# EAGLE design Board Schematic (EAGLE 9.1.3)
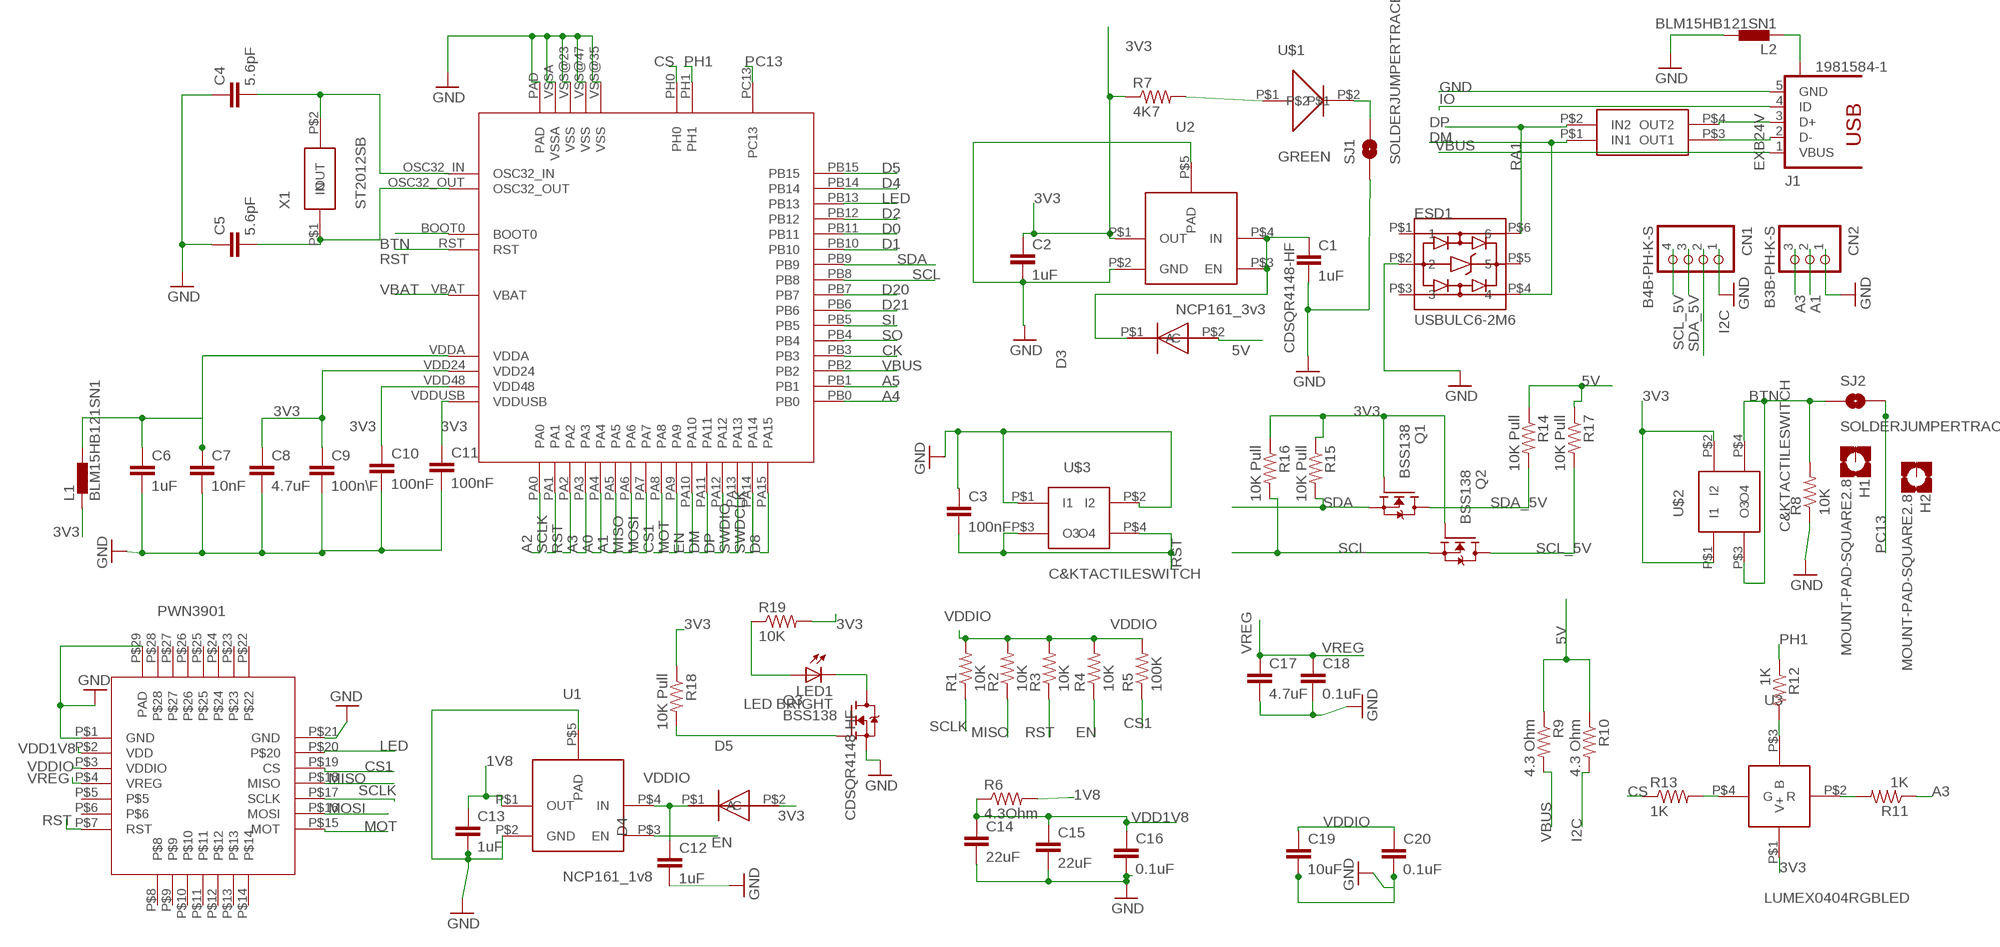
[diagram p0: schematic, sheet 1]

## Parts
C1  1uF  0402CAP.KW  [0402-CAP]
C2  1uF  0402CAP.KW  [0402-CAP]
C3  100nF  0402CAP.KW  [0402-CAP]
C4  5.6pF  0402CAP.KW  [0402-CAP]
C5  5.6pF  0402CAP.KW  [0402-CAP]
C6  1uF  0402CAP.KW  [0402-CAP]
C7  10nF  0402CAP.KW  [0402-CAP]
C8  4.7uF  0402CAP.KW  [0402-CAP]
C9  100n\F  0402CAP.KW  [0402-CAP]
C10  100nF  0402CAP.KW  [0402-CAP]
C11  100nF  0402CAP.KW  [0402-CAP]
C12  1uF  0402CAP.KW  [0402-CAP]
C13  1uF  0402CAP.KW  [0402-CAP]
C14  22uF  0402CAP.KW  [0402-CAP]
C15  22uF  0402CAP.KW  [0402-CAP]
C16  0.1uF  0402CAP.KW  [0402-CAP]
C17  4.7uF  0402CAP.KW  [0402-CAP]
C18  0.1uF  0402CAP.KW  [0402-CAP]
C19  10uF  0402CAP.KW  [0402-CAP]
C20  0.1uF  0402CAP.KW  [0402-CAP]
CN1  B4B-PH-K-S  [B4B-PH-K-S]
CN2  B3B-PH-K-S  [B3B-PH-K-S]
D3  CDSQR4148-HF  [CDSQR4148-HF]
D4  CDSQR4148-HF  [CDSQR4148-HF]
ESD1  USBULC6-2M6  [UQFN6]
H1  MOUNT-PAD-SQUARE2.8  [2,8-PAD-SQUARE]
H2  MOUNT-PAD-SQUARE2.8  [2,8-PAD-SQUARE]
J1  1981584-1  [1981584-1]
L1  BLM15HB121SN1  [0402]
L2  BLM15HB121SN1  [0402]
LED1  LED BRIGHT  LED  [LM561C]
PWN3901  COB_PMW3901  [COB]
Q1  BSS138  [SOT23]
Q2  BSS138  [SOT23]
Q3  BSS138  [SOT23]
R1  10K  0402RES.KW  [0402-RES]
R2  10K  0402RES.KW  [0402-RES]
R3  10K  0402RES.KW  [0402-RES]
R4  10K  0402RES.KW  [0402-RES]
R5  100K  0402RES.KW  [0402-RES]
R6  4.3Ohm  0402RES.KW  [0402-RES]
R7  4K7  0402RES.KW  [0402-RES]
R8  10K  0402RES.KW  [0402-RES]
R9  4.3 Ohm  0402RES.KW  [0402-RES]
R10  4.3 Ohm  0402RES.KW  [0402-RES]
R11  1K  0402RES.KW  [0402-RES]
R12  1K  0402RES.KW  [0402-RES]
R13  1K  0402RES.KW  [0402-RES]
R14  10K Pull  0402RES.KW  [0402-RES]
R15  10K Pull  0402RES.KW  [0402-RES]
R16  10K Pull  0402RES.KW  [0402-RES]
R17  10K Pull  0402RES.KW  [0402-RES]
R18  10K Pull  0402RES.KW  [0402-RES]
R19  10K  0402RES.KW  [0402-RES]
RA1  EXB24V  [EXB24V]
SJ1  SOLDERJUMPERTRACE  [SJ_2S-TRACE]
SJ2  SOLDERJUMPERTRACE  [SJ_2S-TRACE]
U1  NCP161_1v8  NCP161  [NCP161]
U2  NCP161_3v3  NCP161  [NCP161]
U3  LUMEX0404RGBLED  [LX0404]
U$1  GREEN  0402LED  [0402LED]
U$2  C&KTACTILESWITCH  [C&KTACTILESWITCH]
U$3  C&KTACTILESWITCH  [C&KTACTILESWITCH]
U$4  STM32L433  [QFN50P700X700X60-49N]
X1  ST2012SB  [ST2012SB]

## Nets
1V8: C13.1 R6.2 U1.P$1(OUT)
3V3: C2.1 C8.1 C9.1 C10.1 C11.1 D4.P$2(A) L1.1 Q1.1(G) Q2.1(G) R7.1 R15.1 R16.1 R18.1 R19.2 U2.P$1(OUT) U3.P$1(V+) U$2.P$1(I1) U$2.P$2(I2) U$4.VDD24 U$4.VDD48 U$4.VDDUSB
5V: D3.P$2(A) R9.1 R10.1 R14.1 R17.1
A0: U$4.PA4
A1: CN2.2 U$4.PA5
A2: U$4.PA0
A3: CN2.3 R11.1 U$4.PA3
A4: U$4.PB0
A5: U$4.PB1
BTN: R8.2 SJ2.1 U$2.P$3(O3) U$2.P$4(O4) U$4.BOOT0
CK: U$4.PB3
CS: R13.1 U$4.PH0
CS1: PWN3901.P$19(CS) R5.1 U$4.PA8
D0: U$4.PB11
D1: U$4.PB10
D2: U$4.PB12
D4: U$4.PB14
D5: Q3.1(G) R18.2 U$4.PB15
D8: U$4.PA15
D20: U$4.PB7
D21: U$4.PB6
DM: ESD1.P$4 RA1.P$1(IN1) U$4.PA11
DP: ESD1.P$6 RA1.P$2(IN2) U$4.PA12
EN: R4.1 U1.P$3(EN) U$4.PA10
GND: C1.2 C2.2 C3.1 C4.1 C5.1 C6.2 C7.2 C8.2 C9.2 C10.2 C11.2 C12.2 C13.2 C14.2 C15.2 C16.2 C17.2 C18.2 C19.2 C20.2 CN1.1 CN2.1 ESD1.P$2 J1.5(GND) L2.2 PWN3901.P$1(GND) PWN3901.P$21(GND) PWN3901.P$29(PAD) Q3.2(S) R8.1 SJ1.1 U1.P$2(GND) U1.P$5(PAD) U2.P$2(GND) U2.P$5(PAD) U$3.P$1(I1) U$3.P$2(I2) U$4.PAD U$4.VSS@23(VSS) U$4.VSS@35(VSS) U$4.VSS@47(VSS) U$4.VSSA
I2C: CN1.2 R10.2
IO: J1.4(ID)
LED: PWN3901.P$20 U$4.PB13
MISO: PWN3901.P$18(MISO) R2.1 U$4.PA6
MOSI: PWN3901.P$16(MOSI) U$4.PA7
MOT: PWN3901.P$15(MOT) U$4.PA9
N$1: C4.2 U$4.OSC32_IN X1.P$2(OUT)
N$4: C6.1 C7.1 L1.2 U$4.VDDA
N$5: R13.2 U3.P$4(G)
N$6: C5.2 U$4.OSC32_OUT X1.P$1(IN)
N$7: R12.2 U3.P$3(B)
N$8: R11.2 U3.P$2(R)
N$9: J1.S1 L2.1
N$10: J1.3(D+) RA1.P$4(OUT2)
N$11: J1.2(D-) RA1.P$3(OUT1)
N$12: R7.2 U$1.P$1
N$13: SJ1.2 U$1.P$2
N$14: LED1.A1(A) LED1.A2(A) LED1.A3(A) R19.1
N$15: LED1.C1(C) LED1.C2(C) LED1.C3(C) Q3.3(D)
N$16: C1.1 D3.P$1(C) U2.P$3(EN) U2.P$4(IN)
PC13: SJ2.2 U$4.PC13
PH1: R12.1 U$4.PH1
RST: C3.2 PWN3901.P$7(RST) R3.1 U$3.P$3(O3) U$3.P$4(O4) U$4.PA2 U$4.RST
SCL: Q2.2(S) R16.2 U$4.PB8
SCL_5V: CN1.4 Q2.3(D) R17.2
SCLK: PWN3901.P$17(SCLK) R1.1 U$4.PA1
SDA: Q1.2(S) R15.2 U$4.PB9
SDA_5V: CN1.3 Q1.3(D) R14.2
SI: U$4.PB5
SO: U$4.PB4
SWDCLK: U$4.PA14
SWDIO: U$4.PA13
VBAT: U$4.VBAT
VBUS: J1.1(VBUS) R9.2 U$4.PB2
VDD1V8: C14.1 C15.1 C16.1 PWN3901.P$2(VDD) R6.1
VDDIO: C12.1 C19.1 C20.1 D4.P$1(C) PWN3901.P$3(VDDIO) R1.2 R2.2 R3.2 R4.2 R5.2 U1.P$4(IN)
VREG: C17.1 C18.1 PWN3901.P$4(VREG)
Unconnected: ESD1.P$1 ESD1.P$3 ESD1.P$5 H1.B2,8(MOUNT) H2.B2,8(MOUNT) PWN3901.P$5 PWN3901.P$6 PWN3901.P$8 PWN3901.P$9 PWN3901.P$10 PWN3901.P$11 PWN3901.P$12 PWN3901.P$13 PWN3901.P$14 PWN3901.P$22 PWN3901.P$23 PWN3901.P$24 PWN3901.P$25 PWN3901.P$26 PWN3901.P$27 PWN3901.P$28

## Library data of the parts
C1-C20 = ladybug:0402CAP.KW; OC_NEWARK: unknown
CN1 = jst-ph:B4B-PH-*: Wire-to-Board 2.0mm pitch top mount connector Source: http://www.jst-mfg.com/product/pdf/jpn/PH.pdf http://www.jst-mfg.com/product/detail.php?series=199; OC_NEWARK: unknown
CN2 = jst-ph:B3B-PH-*: Wire-to-Board 2.0mm pitch top mount connector Source: http://www.jst-mfg.com/product/pdf/jpn/PH.pdf http://www.jst-mfg.com/product/detail.php?series=199; OC_NEWARK: unknown
D3 D4 = ladybug:CDSQR4148-HF: ComChip's CDSQR4148-HF high speed 150 mA Io diode; OC_NEWARK: unknown
ESD1 = ELL-i-PowerIC:USBULC6-2M6: Large bandwidth ESD protection Usable for ESD protection of USB, Ethernet, Video, etc Datasheet <http://www.st.com/web/en/resource/technical/document/datasheet/CD00178569.pdf>
H1 H2 = holes:MOUNT-PAD-SQUARE: MOUNTING PAD, square; OC_NEWARK: unknown
J1 = ladybug:1981584-1: Receptacle, micro-USB, type A/B Tyco Electronics; OC_NEWARK: unknown
L1 L2 = ladybug:BLM15H: EMIFIL (R) Chip Ferrite Bead for GHz Noise Source: http://www.murata.com/ Ferrite Bead BLM15H.pdf; OC_NEWARK: unknown
LED1 = PowerComponents:LED
PWN3901 = Optical Flow Sensor:COB_PMW3901; OC_NEWARK: unknown
Q1-Q3 = bss138_10:BSS138: BSS138 N-Channel Logic Level Enhancement Mode Field Effect Transistor Source: http://www.fairchildsemi.com/datasheets/BS/BSS138.pdf; MF: Fairchild; MPN: BSS138; OC_FARNELL: 9845330; OC_NEWARK: 67R2009
R1-R10 R14-R19 = ladybug:0402RES.KW; OC_NEWARK: unknown
R11-R13 = SparkFun-Resistors:0402RES.KW
RA1 = ladybug:EXB24V: Panasonic EXB24 22 Ohm series resistor pair; OC_NEWARK: unknown
SJ1 SJ2 = ladybug:SOLDERJUMPER: Solder Jumper Standard SMD solder jumper. Used to automate production. Two varients : Normally Open and Normally Closed are the same, but have different paste layers. NC will have a large amount of paste and should jumper during reflow.; OC_NEWARK: unknown
U1 U2 = ladybug:NCP161: NCP161 3V3 LDO voltage regulator; OC_NEWARK: unknown
U3 = Kris:LUMEX0404RGBLED: Lumex 0404 rgb leds
U$1 = ladybug:0402LED: 0402led; OC_NEWARK: unknown
U$2 U$3 = ladybug:C&KTACTILESWITCH: C&K Tactile Switch 611-PTS810SJS250SMTR; OC_NEWARK: unknown
U$4 = QFN50P700X700X60-49N:STM32L433; OC_NEWARK: unknown
X1 = ladybug:ST2012SB: Kyocera 2.0 x 1.2 mm 32.768 20kHz ppm 4 pf crystal; OC_NEWARK: unknown

## Board
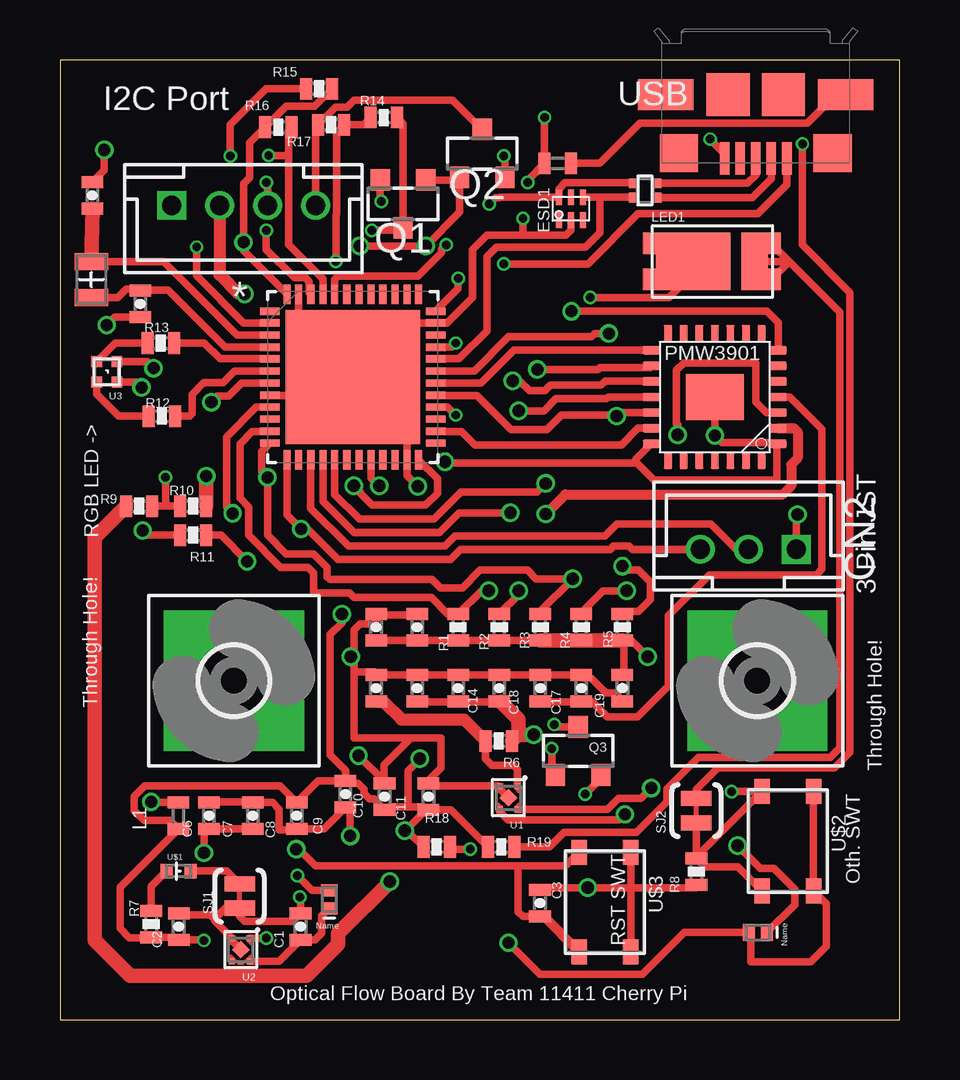
[diagram p1: board, top side]
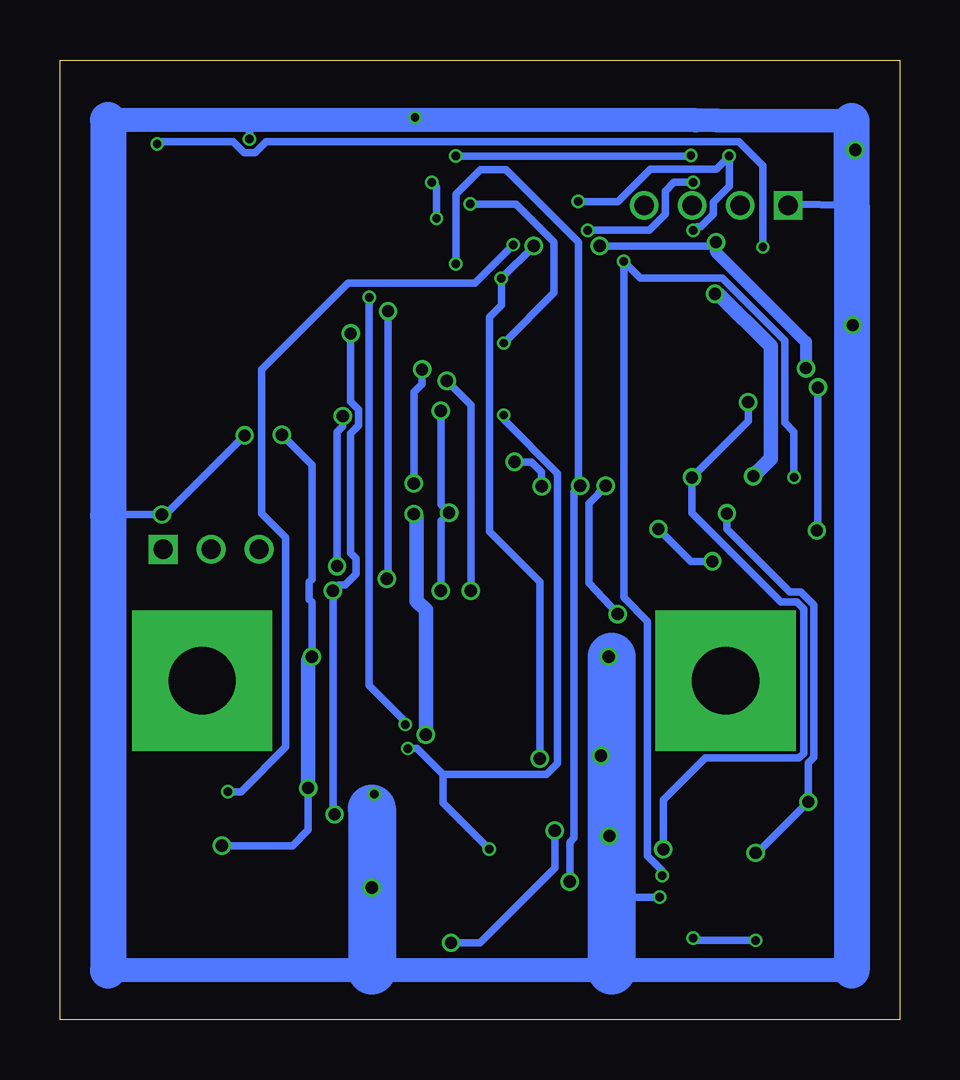
[diagram p2: board, bottom side, seen from below]

Size 35 x 40 mm. Coordinates in mm from the lower left corner, seen from the top.
Outline: 0,0 35,0 35,40 0,40 0,0
Copper layers (1*16): Top 0.035mm / dielectric 1.5mm / Bottom 0.035mm
Design rules "BoardDesign *": minimum track width 5mil, minimum drill 10mil, track to track 5mil, track to pad 5mil, pad to pad 5mil, via to via 5mil, smd to smd 5mil, copper to edge 15mil, drill to drill 6mil, minimum pad ring 4mil, minimum via ring 4mil, stop-mask expansion 4mil, vias tented up to drill 20mil, thermal gap 10mil

### Footprints (pad centres in the part's own frame; a part is rotated, then mirrored left to right if it is on the bottom)
0402-CAP = smd 0.5 x 0.9: 1 -0.55,0; 2 0.55,0
B4B-PH-K-S = drill 0.8 square: 1 -3,0 | drill 0.8: 2 -1,0; 3 1,0; 4 3,0
B3B-PH-K-S = drill 0.8 square: 1 -2,0 | drill 0.8: 2 0,0; 3 2,0
CDSQR4148-HF = smd 0.7 x 0.5: P$1 0,0.375; P$2 0,-0.375
UQFN6 = smd 0.25 x 0.65: P$1 -0.5,-0.475; P$2 0,-0.475; P$3 0.5,-0.475; P$4 0.5,0.475; P$5 0,0.475; P$6 -0.5,0.475
2,8-PAD-SQUARE = drill 2.8 pad 5.842 square: B2,8 0,0
1981584-1 = smd 0.4 x 1.35: 1 -1.3,4.1; 2 -0.65,4.1; 3 0,4.1; 4 0.65,4.1; 5 1.3,4.1 | smd 1.8 x 1.8: M1 -1.15,1.45; M2 1.15,1.45 | smd 2.3 x 1.3: S1 -3.75,1.45; S2 3.75,1.45 | smd 1.6 x 1.6: S3 -3.2,3.885; S4 3.2,3.885
0402 = smd 0.5 x 0.9: 1 -0.55,0; 2 0.55,0
LM561C = smd 1.1 x 2.4: A1 1.755,0 | smd 1.65 x 0.9: A2 2.025,0.75; A3 2.025,-0.75 | smd 3.1 x 2.4: C1 -0.8,0 | smd 3.65 x 0.9: C2 -1.075,0.75; C3 -1.075,-0.75
COB = smd 0.7 x 0.35: P$1 -2.65,1.95; P$2 -2.65,1.3; P$3 -2.65,0.65; P$4 -2.65,0; P$5 -2.65,-0.65; P$6 -2.65,-1.3; P$7 -2.65,-1.95; P$15 2.65,-1.95; P$16 2.65,-1.3; P$17 2.65,-0.65; P$18 2.65,0; P$19 2.65,0.65; P$20 2.65,1.3; P$21 2.65,1.95 | smd 0.35 x 0.7: P$8 -1.95,-2.65; P$9 -1.3,-2.65; P$10 -0.65,-2.65; P$11 0,-2.65; P$12 0.65,-2.65; P$13 1.3,-2.65; P$14 1.95,-2.65; P$22 1.95,2.65; P$23 1.3,2.65; P$24 0.65,2.65; P$25 0,2.65; P$26 -0.65,2.65; P$27 -1.3,2.65; P$28 -1.95,2.65 | smd 2.4 x 1.9: P$29 0,0
SOT23 = smd 0.8 x 0.9: 1 -0.95,-1; 2 0.95,-1; 3 0,1
0402-RES = smd 0.5 x 0.9: 1 -0.55,0; 2 0.55,0
EXB24V = smd 0.4 x 0.36: P$1 -0.3,0.5; P$2 0.3,0.5; P$3 -0.3,-0.5; P$4 0.3,-0.5
SJ_2S-TRACE = smd 0.635 x 1.27: 1 -0.508,0; 2 0.508,0
NCP161 = smd 0.24 x 0.24: P$1 -0.37,-0.48; P$2 0.37,-0.48; P$3 0.37,0.48; P$4 -0.37,0.48 | smd 0.52 x 0.52 rotated 45: P$5 0,0
LX0404 = smd 0.45 x 0.45: P$1 -0.425,-0.425; P$2 -0.425,0.425; P$3 0.425,0.425; P$4 0.425,-0.425
0402LED = smd 0.5 x 0.6: P$1 -0.5,0; P$2 0.5,0
C&KTACTILESWITCH = smd 1.05 x 0.65: P$1 -2.075,1.073; P$2 2.075,1.075; P$3 -2.075,-1.075; P$4 2.075,-1.075
QFN50P700X700X60-49N = smd 0.3 x 0.813: BOOT0 -0.762,3.454; PA3 -2.743,-3.454; PA4 -2.261,-3.454; PA5 -1.753,-3.454; PA6 -1.245,-3.454; PA7 -0.762,-3.454; PA14 2.743,3.454; PA15 2.261,3.454; PB0 -0.254,-3.454; PB1 0.254,-3.454; PB2 0.762,-3.454; PB3 1.753,3.454; PB4 1.245,3.454; PB5 0.762,3.454; PB6 0.254,3.454; PB7 -0.254,3.454; PB8 -1.245,3.454; PB9 -1.753,3.454; PB10 1.245,-3.454; PB11 1.753,-3.454; VDD24 2.743,-3.454; VDD48 -2.743,3.454; VSS@23 2.261,-3.454; VSS@47 -2.261,3.454 | smd 0.813 x 0.3: OSC32_IN -3.454,1.753; OSC32_OUT -3.454,1.245; PA0 -3.454,-1.753; PA1 -3.454,-2.261; PA2 -3.454,-2.743; PA9 3.454,-0.254; PA10 3.454,0.254; PA11 3.454,0.762; PA12 3.454,1.245; PA13 3.454,1.753; PB12 3.454,-2.743; PB13 3.454,-2.261; PB14 3.454,-1.753; PB15 3.454,-1.245; PC13 -3.454,2.261; PH0 -3.454,0.762; PH1 -3.454,0.254; RST -3.454,-0.254; VBAT -3.454,2.743; VDDA -3.454,-1.245; VDDUSB 3.454,2.743; VSS@35 3.454,2.261; VSSA -3.454,-0.762 | smd 0.813 x 0.305: PA8 3.454,-0.762 | smd 5.588 x 5.588: PAD 0,0
ST2012SB = smd 0.7 x 1.4: P$1 -0.75,0; P$2 0.75,0

### Placement (x,y rotation side)
C1  10.03,3.88 90 top
C2  4.95,3.88 90 top
C3  20.01,4.85 270 top
C4  1.35,34.35 270 top
C5  3.35,29.83 90 top
C6  6.21,8.49 90 top
C7  8.04,8.49 90 top
C8  9.87,8.49 270 top
C9  11.9,9.39 270 top
C10  13.53,9.29 90 top
C11  15.36,9.29 90 top
C12  13.18,16.36 90 top
C13  13.18,13.81 90 top
C14  18.31,13.81 90 top
C15  16.6,13.81 90 top
C16  14.89,13.81 90 top
C17  21.73,13.81 90 top
C18  20.02,13.81 90 top
C19  23.44,13.81 270 top
C20  14.89,16.36 90 top
CN1  7.65,33.94 0 top
CN2  28.7,19.6 180 top
D3  11.23,5.02 180 top
D4  29.09,3.63 270 top
ESD1  21.3,33.8 0 top
H1  29.07,14.12 180 top
H2  7.25,14.12 0 top
J1  29,40 180 top
L1  4.94,8.49 90 top
L2  20.75,35.69 180 top
LED1  27.2,31.6 0 top
PWN3901  27.3,25.95 180 top
Q1  14.3,34 180 top
Q2  17.6,36.1 0 top
Q3  21.6,11.2 0 top
R1  16.6,16.36 270 top
R2  18.31,16.36 270 top
R3  20.02,16.36 270 top
R4  21.73,16.36 270 top
R5  23.44,16.36 270 top
R6  18.3,11.61 180 top
R7  3.8,3.98 90 top
R8  26.53,6.17 90 top
R9  3.3,21.4 180 top
R10  5.55,21.4 0 top
R11  5.55,20.19 180 top
R12  4.25,25.15 180 top
R13  4.2,28.2 180 top
R14  13.5,37.6 0 top
R15  10.8,38.8 180 top
R16  9.1,37.2 0 top
R17  11.3,37.3 180 top
R18  15.7,7.2 0 top
R19  18.4,7.2 180 top
RA1  24.39,34.56 90 top
SJ1  7.49,5.15 90 top
SJ2  26.53,8.71 90 top
U1  18.7,9.24 180 top
U2  7.54,2.91 180 top
U3  1.95,27 180 top
U$1  4.94,6.19 0 top
U$2  30.34,7.44 270 top
U$3  22.72,4.9 270 top
U$4  12.21,26.78 0 top
X1  1.31,30.85 90 top

### Tracks (layer width: path | path; a pad name or v marks a point on that pad's centre or on a via)
1V8
  Top 0.305: R6.2 17.75,10.86 18,10.6 18.9,10.6 19.07,10.43 U1.P$1 | C13.1 13.23,13.27 13.25,13.25
  Top 0.508: 13.25,13.25 13.49,13.25 14.23,12.51 16.85,12.51 R6.2
3V3  (via drill 0.35, 0.51, 0.51 pad 0.76)
  Top 0.305: v11.75,16.9 11.75,16.54 11.26,16.05 11.26,11.03 11.9,10.39 C9.1 | U$4.VDD24 15.73,22.54 15.73,21.93 15.25,21.44 13,21.44 12.52,21.92 12.52,21.98 v12.25,22.25 | v15,10.88 14.5,10.38 14.5,8.88 | 14.5,8.88 13.75,8.88 13.62,8.75 C10.1 13.09,9.19 12.91,9.19 12.67,9.43 12.67,9.6 12.43,9.85 12.18,9.85 12.08,9.95 C9.1 | v12.5,32.25 v15.25,32.25 16.65,33.65 Q2.1 16.55,35 Q1.1 | 15.25,8.62 15.12,8.62 v14.38,7.88 14.47,7.88 R18.1 | 15.25,8.62 C11.1 16.3,8.74 R19.2 | 14.5,8.88 15,8.88 15.25,8.62 | v18.7,3.2 20.01,1.89 24.29,1.89 26.02,3.63 D4.P$2 28.8,3.54 28.8,2.4 31.3,2.4 31.95,3.05 31.95,4.83 U$2.P$2 U$2.P$1 | U$4.VDD48 7.65,32.05 v7.65,32.4 7.65,34.85 7.9,35.1 7.9,36.55 R16.1 9.42,38.07 10.62,38.07 R15.1 | U3.P$1 3.62,27.43 v3.9,27.15 | U$4.VDDUSB 16.6,30.46 v16.6,30.9 | U2.P$1 v8.59,3.39 v8.6,3.4 | v6,3.3 5.97,3.33 C2.1 4.85,3.43 R7.1 3.81,3.42 2.88,3.42 2.5,3.8 2.5,5.5 L1.1 4.58,8.3 3.5,8.3 3.1,8.7 3.1,9.31 3.53,9.73 9.18,9.73 C8.1 10.77,9.95 C9.1
  Bottom 0.305: v11.75,16.9 12.94,18.19 12.94,21.5 12.52,21.92 12.52,21.98 v12.25,22.25 | v15,10.88 15,18.25 17.1,20.35 17.1,29.29 16.6,29.79 v16.6,30.9 v15.25,32.25 | v12.5,32.25 7.8,32.25 v7.65,32.4 | v14.38,7.88 14.38,6.33 17.5,3.2 v18.7,3.2 | v6,3.3 8.5,3.3 v8.6,3.4
  Bottom 0.508: v7.65,32.4 7.65,32 3.9,28.25 v3.9,27.15
5V  (via drill 0.35)
  Top 0.305: v11.5,31.6 11.5,33.55 11.53,33.58 11.53,36.98 | R10.1 4.4,21.4 | 4.4,21.4 R9.1 | v4.4,22.6 4.4,21.4 | 11.53,36.98 | 11.53,36.98 R17.1 12.65,37.3 R14.1 | v9.9,6 10.51,5.39 D3.P$2
  Bottom 0.305: v4.4,22.6 4.4,24.5 4.78,24.88 4.78,28.3 7.38,30.91 10.81,30.91 v11.5,31.6 11.5,17.58 10.51,16.59 10.51,6.83 9.9,6.22 v9.9,6
A1
  Top 0.305: CN2.2 28.2,19.6 27.14,20.66 23.21,20.66 22.71,20.16 16.47,20.16 16.05,19.74 12.02,19.74 10.46,21.3 U$4.PA5
A3  (via drill 0.51, 0.51 pad 0.76)
  Top 0.305: CN2.3 23.86,19.6 23.73,19.73 23.07,19.73 22.94,19.6 16.7,19.6 16.28,19.18 11.59,19.18 10.32,20.45 v10.05,20.45 9.47,21.03 U$4.PA3 | v7.8,19.1 6.71,20.19 R11.1
  Bottom 0.305: v7.8,19.1 8.7,19.1 v10.05,20.45
BTN  (via drill 0.35)
  Top 0.305: U$2.P$4 29.25,5.38 28.25,6.38 26.88,6.38 R8.2 26.5,6.75 26.53,6.78 | 26.53,6.78 U$2.P$3 28.02,9.52 v28,9.5 | SJ2.1 26.53,6.78 | U$4.BOOT0 11.45,30.85 11.6,31 14.93,31 15.91,31.98 15.91,32.11 v16.1,32.3
  Bottom 0.305: v16.1,32.3 17.7,30.7 23,30.7 26.6,27.1 26.6,21.1 25.6,20.1 25.6,11.36 27.46,9.5 v28,9.5
CS
  Top 0.305: R13.1 6.02,28.2 6.68,27.54 U$4.PH0
CS1  (via drill 0.51)
  Top 0.305: R5.1 23.55,17.01 24.11,17.01 24.61,17.52 24.61,18.23 24.11,18.74 23.61,18.74 v23.45,18.9 | U$4.PA8 17.38,26.02 18.8,24.6 20.3,24.6 20.9,25.2 23.17,25.2 v23.21,25.16 23.35,25.3 PWN3901.P$19
  Bottom 0.305: v23.45,18.9 23.45,24.48 23.21,24.72 v23.21,25.16
D5  (via drill 0.35)
  Top 0.305: U$4.PB15 16.16,25.54 v16.5,25.2 | v20.5,11.3 20.5,10.35 Q3.1 | R18.2 16.35,7.1 v17.1,7.1
  Bottom 0.305: v20.5,11.3 20.11,11.3 19.02,10.21 | v16.5,25.2 16.5,25.01 14.26,22.77 14.26,10.68 14.73,10.21 19.02,10.21 | v17.1,7.1 19.02,9.02 19.02,10.21
DM
  Top 0.305: ESD1.P$4 22.5,34.27 | 22.5,34.27 23.88,34.27 RA1.P$1 | U$4.PA11 16.64,27.54 17.8,28.7 17.8,31.8 18.2,32.2 21.9,32.2 22.5,32.8 22.5,34.27
DP  (via drill 0.35)
  Top 0.305: U$4.PA12 16.32,28.02 v16.5,28.2 | RA1.P$2 23.87,34.88 21.06,34.88 20.8,34.62 ESD1.P$6 18.34,34.27 18.32,34.26 18.16,34.26 v17.9,34
  Bottom 0.305: v17.9,34 16,34 14.4,32.4 14.4,30.3 v16.5,28.2
EN  (via drill 0.51)
  Top 0.305: R4.1 21.75,17 22.62,17.88 v23.62,17.88 | U$4.PA10 17.27,27.03 18.7,28.46 22.16,28.46 22.3,28.6 v22.88,28.6 | U1.P$3 18.33,8.67 18.67,8.33 23.33,8.33 v23.55,8.55
  Bottom 0.305: v22.88,28.6 22.88,25.76 22.55,25.43 22.55,24.77 22.89,24.43 22.89,19.45 22.66,19.23 22.66,18.57 23.12,18.11 23.39,18.11 v23.62,17.88 23.62,8.62 v23.55,8.55
GND  (via drill 0.35, 0.51, 0.51 pad 0.76)
  Top 0.305: C20.2 14.88,16.88 13.21,16.88 C12.2 13.25,16.75 13,16.5 12.5,16.5 12.25,16.25 12.25,15.12 | 12.25,14.5 12.25,15.12 | 12.25,14.5 13.12,14.5 C13.2 13.25,14.38 14.88,14.38 C16.2 15,14.38 16.5,14.38 C15.2 16.75,14.38 18.25,14.38 C14.2 18.38,14.38 19.88,14.38 C18.2 20.12,14.38 21.62,14.38 C17.2 21.75,14.25 22.12,14.25 22.75,13.62 23.12,13.62 23.38,13.38 23.38,13.34 C19.2 | 6.44,4.19 6.25,4.38 5,4.38 C2.2 | 18.25,9.75 15.38,9.75 C11.2 15.38,10 15.88,10.5 15.88,11.75 14.62,11.75 | 18.25,9.75 U1.P$2 | 14.62,11.75 13.5,10.62 13.5,10 C10.2 13.5,9.88 13.5,9.95 v12.45,11 | 12.25,14.5 12.25,11.75 14.62,11.75 | v12.12,15.12 12.25,15.12 | 23.75,5.5 26.5,5.5 R8.1 | PWN3901.P$21 24.62,24 24,23.38 24,23.25 | 29.88,24 29.88,22.5 24.75,22.5 24,23.25 | 6.44,4.19 6.89,4.64 SJ1.1 7.49,4.31 7.7,4.1 9.7,4.1 C1.2 10.03,5.07 v10,5.1 | U1.P$5 18.25,9.7 18.25,9.75 | v12.1,7.65 12.1,8.64 C9.2 11.01,7.95 C8.2 9.82,7.9 9.14,7.9 9.14,8.76 8.86,9.04 C7.2 8,9.08 6.24,9.08 C6.2 | CN2.1 30.7,21 v30.75,21.05 | 24,23.25 23.95,23.2 16.1,23.2 v16.05,23.25 | 23.75,5.5 v22,5.5 20.11,5.5 C3.1 | C5.1 2.28,29.28 v1.95,28.95 | 29.88,24 29.62,24 29.57,24.06 27.59,24.06 v27.3,24.35 PWN3901.P$29 | U2.P$5 7.17,3.28 U2.P$2 6.44,4.12 6.44,4.19 | C4.1 1.85,35.4 v1.85,36.25 | U$3.P$1 23.79,5.54 23.75,5.5 | U$3.P$2 23.8,5.46 23.75,5.5 | v14.92,22.23 14.47,22.68 U$4.VSS@23 14.47,24.52 U$4.PAD | Q3.2 22.55,10.05 v21.9,9.4 | J1.5 27.7,36.1 v27.1,36.7 | 19.3,32.7 17.8,32.7 17.2,32.1 17.2,30.1 16.14,29.04 U$4.VSS@35 14.47,29.04 U$4.PAD | 19.3,32.7 21.1,32.7 21.3,32.9 ESD1.P$2 | U$4.VSS@47 9.95,29.04 U$4.PAD | U$4.VSSA 11.45,26.02 U$4.PAD
  Top 0.305: PWN3901.P$1 29.88,24 | v20.2,37.6 L2.2 19.5,34.99 v19.5,34.9 | 19.3,32.7 v19.3,33.4
  Bottom 0.305: CN1.1 4.62,34 2,33.95 1.95,33.95 v1.95,28.95 | v12.12,15.12 12,15.12 | v22,5.5 22,8.8 21.9,8.9 v21.9,9.4 | v12.45,11 12.45,8 v12.1,7.65 | 33,21 32.95,21.05 v30.75,21.05 30.6,21.05 v27.3,24.35 | v16.05,23.25 15.35,23.25 14.92,22.82 v14.92,22.23 | v1.85,36.25 2,36.4 2,37.45 | v27.1,36.7 27.1,37.5 | v19.5,34.9 19.3,34.7 v19.3,33.4 | v10,5.1 11.8,5.1 12,4.9
  Bottom 1: 33,2.05 22,2.05 12,2.05 2,2.05 | 2,37.45 7.6,37.48 8.5,37.48 12,37.5 27.1,37.5 33,37.5
  Bottom 1.5: 2,37.45 2,33.95 2,2.05 | 33,37.5 33,21 33,2.05
  Bottom 2: 22,8.8 22,2.05 | 12,2.05 12,4.9 12,15.12
I2C  (via drill 0.51, 0.51 pad 0.76)
  Top 0.505: CN1.2 6.65,31.05
  Top 0.508: 6.65,31.05 7.45,30.25 v7.7,30.25
  Top 0.61: R10.2 v6.1,22.65
  Bottom 0.61: v7.7,30.25 7.55,30.25 5.36,28.06 5.36,23.39 v6.1,22.65
LED
  Top 0.305: U$4.PB13 16.73,24.52 17.3,23.95 23.4,23.95 24.1,24.65 PWN3901.P$20
MISO  (via drill 0.51)
  Top 0.305: v19.12,17.88 19.12,17.72 R2.1 | v18.77,21.12 16.64,21.12 15.81,20.3 12.25,20.3 10.96,21.59 U$4.PA6 | v19.12,25.38 20.18,25.38 20.68,25.88 22.79,25.88 22.86,25.95 PWN3901.P$18
  Bottom 0.305: v19.12,25.38 19.12,21.48 v18.77,21.12 19.12,20.77 v19.12,17.88
MOSI  (via drill 0.51)
  Top 0.305: PWN3901.P$16 24.58,27.18 22.51,27.18 22.43,27.1 v19.9,27.1 | U$4.PA7 11.45,22.5 11.45,21.89 12.48,20.86 15.58,20.86 16.72,21.99 19.89,21.99 v20.25,22.35
  Bottom 0.305: v19.9,27.1 19.9,26.5 20.25,26.15 v20.25,22.35
MOT
  Top 0.305: PWN3901.P$15 18.93,27.9 17.55,26.53 U$4.PA9
N$1
  Top 0.305: X1.P$2 4.32,31.6 7.38,28.53 U$4.OSC32_IN
  Top 0.61: X1.P$2 1.36,33.79 C4.2
N$4  (via drill 0.51)
  Top 0.305: v6,6.95 6,7.83 6.12,7.83 6.12,7.86 C6.1 6.25,7.95 C7.1 | U$4.VDDA 8.19,25.54 6.94,24.29 6.94,21.36 v7.2,21.1 | L1.2 3.83,9.04 v3.8,9.07
  Bottom 0.305: v7.2,21.1 7.2,20.45 4.58,17.83 4.11,17.83 3.57,17.29 3.57,10.92 3.8,10.69 v3.8,9.07 5.92,6.95 v6,6.95
N$5
  Top 0.305: R13.2 2.3,28.2 U3.P$4
N$6
  Top 0.305: X1.P$1 2.4,30.1 2.75,30.45 3.28,30.45 C5.2 3.37,30.4 4.5,30.4 6.88,28.02 U$4.OSC32_OUT
N$7
  Top 0.305: U3.P$3 1.52,26.07 2.45,25.15 R12.2
N$8  (via drill 0.51, 0.51 pad 0.76)
  Top 0.305: U3.P$2 3.17,26.57 v3.4,26.35 | R11.2 3.65,20.19 v3.45,20.39
  Bottom 0.305: v3.4,26.35 3.4,20.44 v3.45,20.39
N$9
  Top 0.305: J1.S1 32.34,38.55 31.17,37.37 24.18,37.37 22.5,35.69 L2.1
N$10
  Top 0.305: J1.3 29,35.2 28.66,34.86 RA1.P$4
N$11
  Top 0.305: RA1.P$3 28.86,34.26 29.65,35.05 J1.2
N$12
  Top 0.305: R7.2 3.8,5.55 U$1.P$1
N$13
  Top 0.305: SJ1.2 6.96,6.19 U$1.P$2
N$14
  Top 0.305: R19.1 20.4,7.2 21,7.8 24.03,7.8 25.31,9.08 25.31,9.61 26.62,10.93 32.11,10.93 32.5,11.32 32.5,29.5 30.4,31.6 | 30.4,31.6 29.65,32.35 LED1.A2 29.23,31.87 LED1.A1 | 30.4,31.6 29.65,30.85 LED1.A3 29.23,31.33 LED1.A1 | 30.4,31.6 LED1.A1
N$15  (via drill 0.35)
  Top 0.305: Q3.3 20.7,12.2 v20.6,12.3 | v22.1,30.1 25.38,30.1 LED1.C3 26.12,31.32 LED1.C1 26.12,31.88 LED1.C2
  Bottom 0.305: v20.6,12.3 20.72,12.42 20.72,12.53 22.12,13.93 22.12,30.08 v22.1,30.1
N$16
  Top 0.152: U2.P$3 7.37,2.43 7.46,2.34 7.62,2.34 7.71,2.43 U2.P$4
  Top 0.305: U2.P$4 9.13,2.43 C1.1 10.63,3.33 10.9,3.6 10.9,4.32 D3.P$1
PC13  (via drill 0.35)
  Top 0.305: SJ2.2 26.53,9.6 27.42,10.49 32.29,10.49 32.93,11.14 32.93,30.31 30.95,32.3 v30.95,36.5 | U$4.PC13 7.67,29.04 5.7,31.01 v5.7,32.2
  Bottom 0.305: v5.7,32.2 5.7,35.6 6.7,36.6 26.41,36.6 26.87,36.14 27.33,36.14 27.79,36.6 30.85,36.6 v30.95,36.5
PH1
  Top 0.305: U$4.PH1 7.28,27.03 6.79,26.54 6,26.54 5.51,26.06 5.51,25.27 5.4,25.15 R12.1
RST  (via drill 0.51, 0.51 pad 0.76)
  Top 0.305: R3.1 20.02,17.02 v21.38,18.38 19.85,18.38 19.48,18.74 17.52,18.74 16.78,18 15.86,18 15.52,18.34 11.25,18.34 11.14,18.46 11.14,18.85 10.57,19.41 9.43,19.41 8.65,20.19 v8.65,22.6 8.4,22.85 8.4,23.68 U$4.PA2 | C3.2 19.3,4.3 19.1,4.5 19.1,6.41 | v6.31,25.73 6.55,25.98 7.04,25.98 7.58,26.53 U$4.RST | U$3.P$3 21.08,6.41 19.1,6.41 | 19.1,6.41 10.65,6.41 9.96,7.1 v9.85,7.1 | PWN3901.P$7 29.95,29.05 29.48,29.52 v21.32,29.52
  Top 0.406: U$3.P$4 20.17,4.3 C3.2
  Bottom 0.305: v6.31,25.73 6.3,24.95 v8.65,22.6 8.65,21.11 4.94,17.4 4.29,17.4 4,17.11 4,11.1 4.2,10.9 8.1,10.9 9.85,9.15 v9.85,7.1 | v21.32,29.52 21.32,18.43 v21.38,18.38
SCL  (via drill 0.35)
  Top 0.305: U$4.PB8 10.96,30.86 9.53,32.3 9.53,36 | R16.2 9.53,37.08 9.53,36 | 9.53,36 9.51,36.02 v8.7,36.02 | v18.5,36 18.55,35.95 Q2.2
  Bottom 0.305: v8.7,36.02 8.72,36 v18.5,36
SCL_5V
  Top 0.305: CN1.4 10.65,37.2 R17.2 11.49,38.03 11.97,38.03 12.27,38.33 16.37,38.33 Q2.3
SCLK  (via drill 0.51, 0.51 pad 0.76)
  Top 0.305: PWN3901.P$17 24.62,26.62 22.74,26.62 22.56,26.44 20.45,26.44 20.23,26.21 19.57,26.21 19.16,26.62 v18.88,26.62 | v17.88,17.88 17.57,17.88 R1.1 16.17,16.91 15.48,17.59 12.27,17.59 12.07,17.79 10.64,17.79 10.58,17.85 10.58,18.61 10.34,18.85 9.2,18.85 7.86,20.19 7.86,21.37 7.5,21.73 7.5,24 8.02,24.52 U$4.PA1
  Bottom 0.305: v18.88,26.62 17.88,25.62 v17.88,17.88
SDA  (via drill 0.35)
  Top 0.305: v8.6,32.9 8.6,32.09 9.77,30.92 10.21,30.92 10.38,30.75 10.38,30.31 U$4.PB9 | v7.1,36 7.1,37.3 8.6,38.8 R15.2 | v13.4,34.1 13.35,34.15 Q1.2
  Bottom 0.305: v8.6,32.9 8.44,33.06 8.29,33.06 7.77,33.58 7.77,34.06 7.1,34.73 v7.1,36 7.64,35.46 10.38,35.46 11.73,34.1 v13.4,34.1
SDA_5V  (via drill 0.35)
  Top 0.305: R14.2 14.3,37.35 Q1.3 14.2,32.9 v13,32.9 | CN1.3 8.65,34.85 v8.6,34.9
  Bottom 0.305: v13,32.9 12.78,32.9 12.77,32.91 10.44,32.91 9.77,33.58 9.77,34.53 9.4,34.9 v8.6,34.9
VBUS  (via drill 0.35, 0.51, 0.51 pad 0.76)
  Top 0.305: U$4.PB2 12.97,22.58 v13.3,22.25 v13.31,22.25 | J1.1 30.3,34.8 29.1,33.6 24.1,33.6 22,31.5 v18.5,31.5
  Top 0.61: v13.75,5.75 11.58,3.58 11.58,3.13 10.28,1.83 2.92,1.83 1.45,3.3 1.45,20.1 R9.2
  Bottom 0.305: v13.75,5.75 13.75,7.39 13.57,7.57 13.57,21.99 v13.31,22.25 13.38,22.32 13.38,32.41 16.4,35.42 | 16.4,35.42 | 16.4,35.42 17.48,35.42 18.5,34.4 v18.5,31.5
VDD1V8  (via drill 0.51)
  Top 0.305: C16.1 15,13.25 16.5,13.25 C15.1 16.75,13.25 18.25,13.25 C14.1 18.38,13.25
  Top 0.406: v20.25,21.07 21.07,21.89 30.13,21.89 30.48,22.25 30.48,23.14 30.76,23.41 30.76,24.49 30.6,24.65 PWN3901.P$2
  Top 0.61: v19.75,11.88 19.11,11.88 | 19.11,11.88 R6.1 | 19.11,11.88 19.11,12.52 18.38,13.25
  Bottom 0.61: v19.75,11.88 19.75,17.06 20.14,17.45 20.14,20.97 v20.25,21.07
VDDIO  (via drill 0.51)
  Top 0.305: R3.2 R2.2 R1.2 C20.1 C12.1 | v24.5,15.12 23.82,15.8 R5.2 23.5,15.75 23.5,14.38 23.49,14.37 C19.1 | v28.25,7.25 29.2,6.3 29.76,6.3 30.62,5.43 30.62,4.79 D4.P$1 | v25.75,24.38 25.75,24.77 25.69,24.83 25.69,27.07 26,27.38 29,27.38 29,25.75 29.45,25.3 PWN3901.P$3 | U1.P$4 22.83,8.77 23.28,9.21 24.21,9.21 v24.65,9.65
  Top 0.61: R5.2 R4.2 R3.2
  Bottom 0.305: v25.75,24.38 24.5,23.12 24.5,18.35 24.61,18.23 24.61,17.52 24.5,17.4 v24.5,15.12 | v28.25,7.25 25.3,7.25 24.65,7.9 v24.65,9.65
  Bottom 0.61: v24.65,9.65 24.65,14.97 v24.5,15.12
VREG
  Top 0.305: C18.1 20.12,13.25 21.62,13.25 C17.1 22.17,13.27 22.83,12.61 24.06,12.61 25.36,13.91 25.36,16.84 27.07,18.54 31.52,18.54 31.76,18.78 31.76,24.61 30.43,25.95 PWN3901.P$4

### Text on the board
tPlace: I2C Port | USB | PMW3901 | RGB LED -> | 3 Pin JST | Through Hole! | Through Hole! | RST SWT | Oth. SWT | Optical Flow Board By Team 11411 Cherry Pi